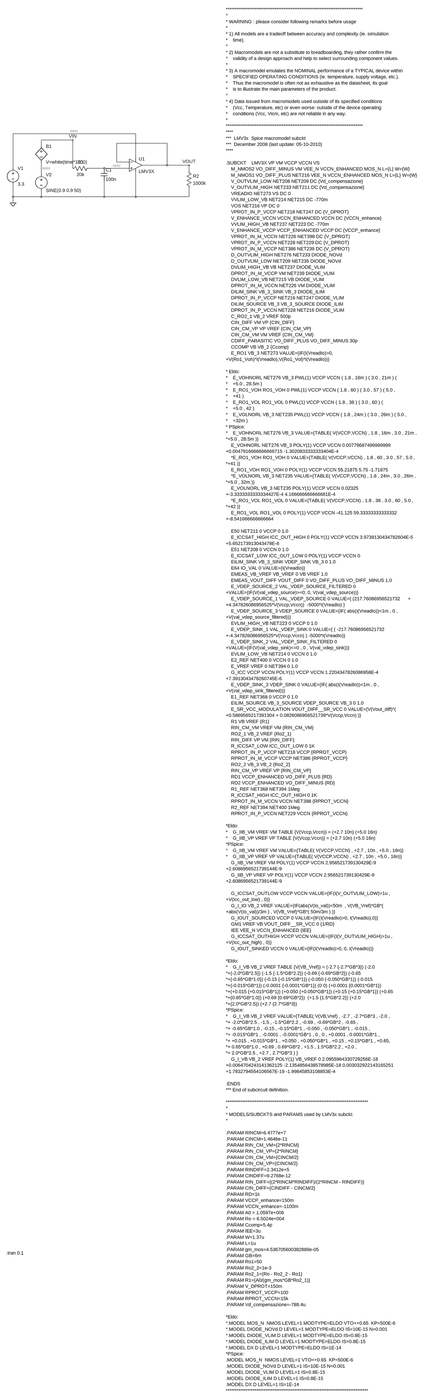
[diagram p0: schematic adc_opamp.asc, whole sheet]
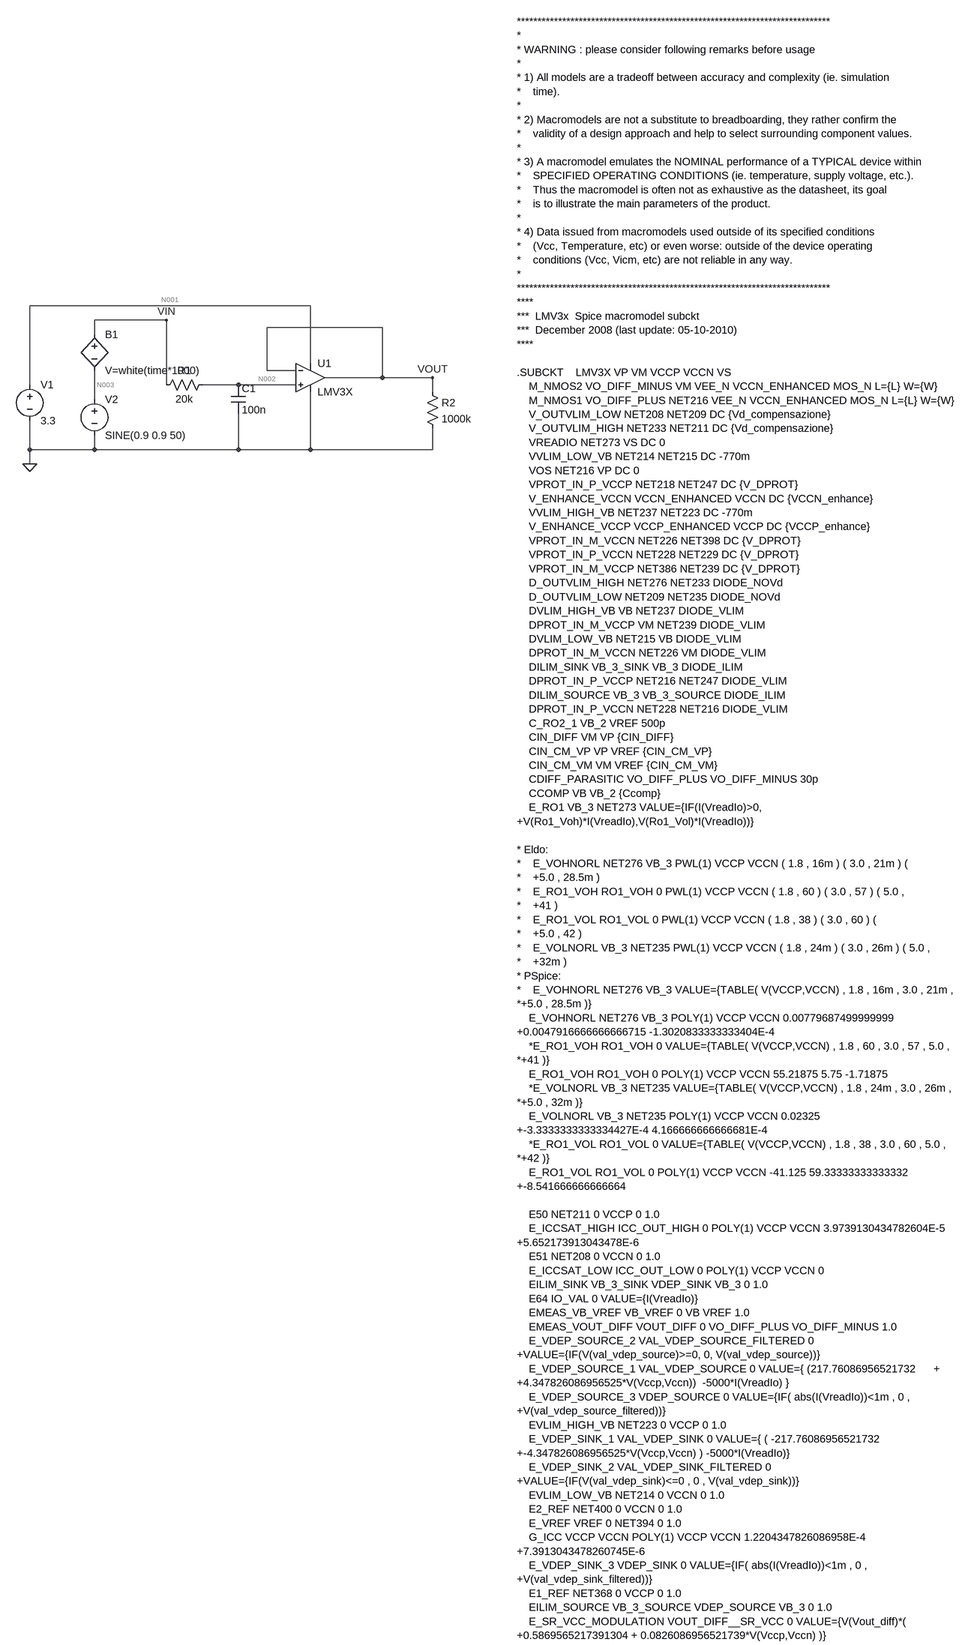
[diagram p1: schematic adc_opamp.asc, part, row 1 of 2, column 1 of 1]
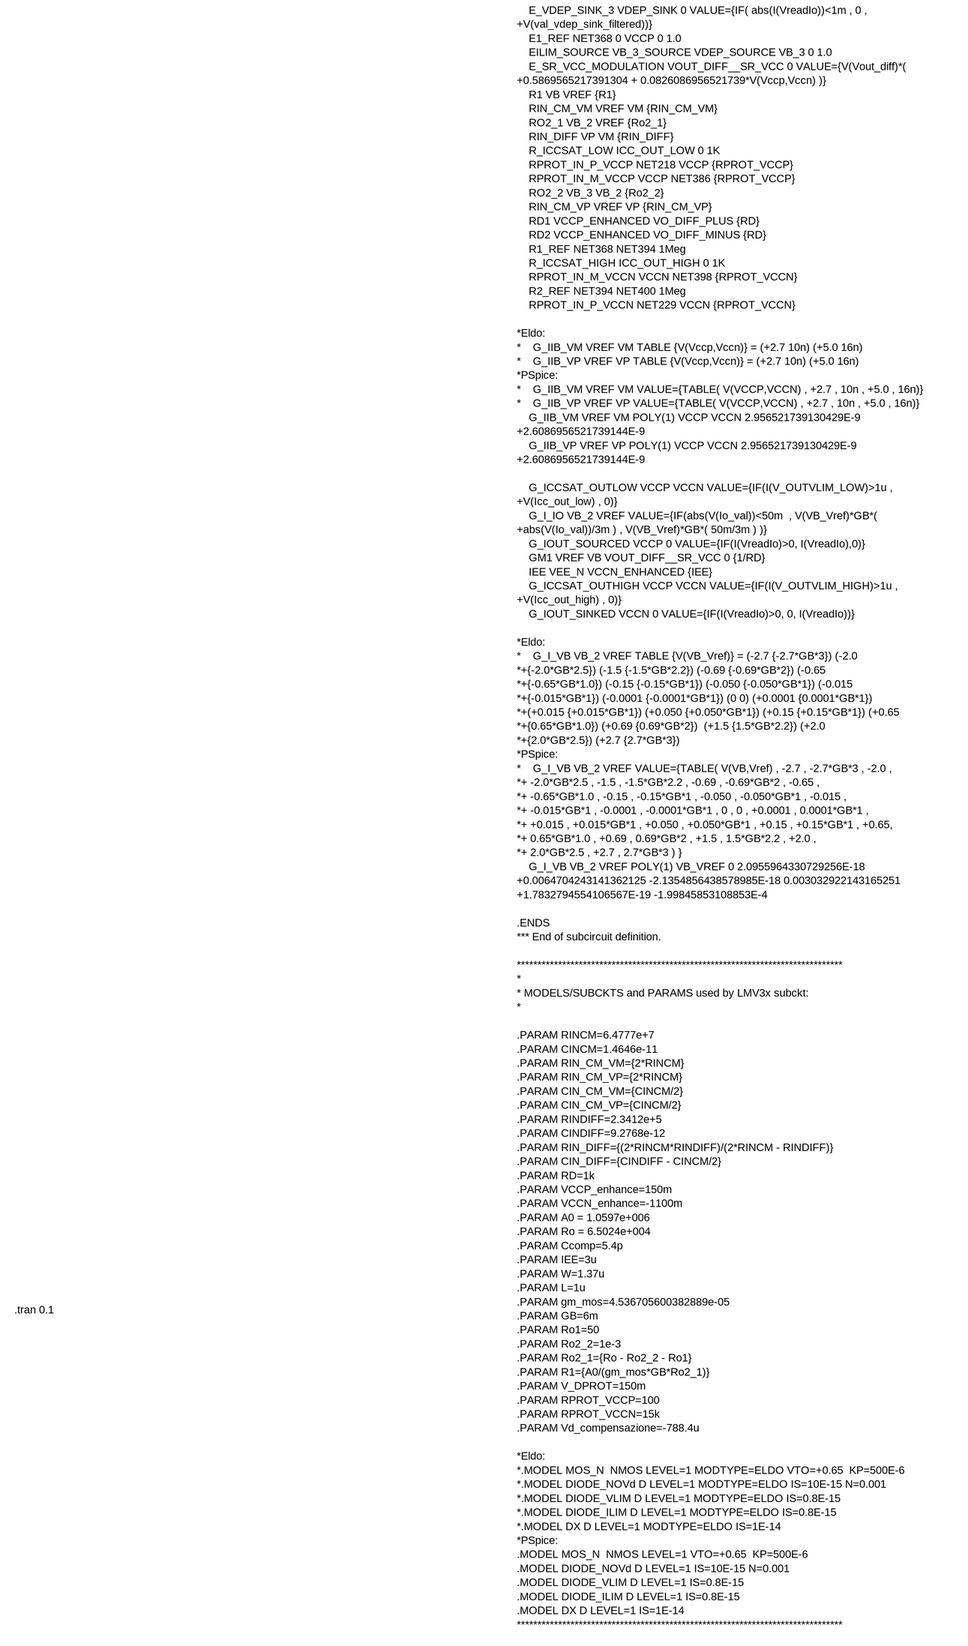
[diagram p2: schematic adc_opamp.asc, part, row 2 of 2, column 1 of 1]
adc_opamp.asc, the LTspice schematic file:
Version 4
SHEET 1 2624 5672
WIRE 656 -32 32 -32
WIRE 336 0 176 0
WIRE 816 16 560 16
WIRE 176 32 176 0
WIRE 656 96 656 -32
WIRE 560 112 560 16
WIRE 624 112 560 112
WIRE 816 128 816 16
WIRE 816 128 688 128
WIRE 928 128 816 128
WIRE 32 144 32 -32
WIRE 336 144 336 0
WIRE 496 144 416 144
WIRE 624 144 496 144
WIRE 928 160 928 128
WIRE 176 176 176 112
WIRE 32 288 32 224
WIRE 176 288 176 256
WIRE 176 288 32 288
WIRE 496 288 496 208
WIRE 496 288 176 288
WIRE 656 288 656 160
WIRE 656 288 496 288
WIRE 928 288 928 240
WIRE 928 288 656 288
WIRE 32 320 32 288
FLAG 32 320 0
FLAG 336 0 VIN
FLAG 928 128 VOUT
SYMBOL voltage 32 128 R0
WINDOW 123 0 0 Left 0
WINDOW 39 0 0 Left 0
SYMATTR InstName V1
SYMATTR Value 3.3
SYMBOL res 432 128 R90
WINDOW 0 0 56 VBottom 2
WINDOW 3 32 56 VTop 2
SYMATTR InstName R1
SYMATTR Value 20k
SYMBOL cap 480 144 R0
SYMATTR InstName C1
SYMATTR Value 100n
SYMBOL OpAmps\\opamp2 656 64 R0
SYMATTR InstName U1
SYMATTR Value LMV3X
SYMBOL res 912 144 R0
SYMATTR InstName R2
SYMATTR Value 1000k
SYMBOL bv 176 16 R0
SYMATTR InstName B1
SYMATTR Value V=white(time*1000)
SYMBOL voltage 176 160 R0
WINDOW 123 0 0 Left 0
WINDOW 39 0 0 Left 0
SYMATTR InstName V2
SYMATTR Value SINE(0.9 0.9 50)
TEXT 1464 -664 Left 2 !****************************************************************************\n*\n* WARNING : please consider following remarks before usage\n*\n* 1) All models are a tradeoff between accuracy and complexity (ie. simulation\n*    time).\n*\n* 2) Macromodels are not a substitute to breadboarding, they rather confirm the\n*    validity of a design approach and help to select surrounding component values.\n*\n* 3) A macromodel emulates the NOMINAL performance of a TYPICAL device within\n*    SPECIFIED OPERATING CONDITIONS (ie. temperature, supply voltage, etc.).\n*    Thus the macromodel is often not as exhaustive as the datasheet, its goal\n*    is to illustrate the main parameters of the product.\n*\n* 4) Data issued from macromodels used outside of its specified conditions\n*    (Vcc, Temperature, etc) or even worse: outside of the device operating\n*    conditions (Vcc, Vicm, etc) are not reliable in any way.\n*\n****************************************************************************\n****\n***  LMV3x  Spice macromodel subckt \n***  December 2008 (last update: 05-10-2010)\n****                      \n  \n.SUBCKT    LMV3X VP VM VCCP VCCN VS\n    M_NMOS2 VO_DIFF_MINUS VM VEE_N VCCN_ENHANCED MOS_N L={L} W={W}\n    M_NMOS1 VO_DIFF_PLUS NET216 VEE_N VCCN_ENHANCED MOS_N L={L} W={W}\n    V_OUTVLIM_LOW NET208 NET209 DC {Vd_compensazione}\n    V_OUTVLIM_HIGH NET233 NET211 DC {Vd_compensazione}\n    VREADIO NET273 VS DC 0\n    VVLIM_LOW_VB NET214 NET215 DC -770m\n    VOS NET216 VP DC 0\n    VPROT_IN_P_VCCP NET218 NET247 DC {V_DPROT}\n    V_ENHANCE_VCCN VCCN_ENHANCED VCCN DC {VCCN_enhance}\n    VVLIM_HIGH_VB NET237 NET223 DC -770m\n    V_ENHANCE_VCCP VCCP_ENHANCED VCCP DC {VCCP_enhance}\n    VPROT_IN_M_VCCN NET226 NET398 DC {V_DPROT}\n    VPROT_IN_P_VCCN NET228 NET229 DC {V_DPROT}\n    VPROT_IN_M_VCCP NET386 NET239 DC {V_DPROT}\n    D_OUTVLIM_HIGH NET276 NET233 DIODE_NOVd\n    D_OUTVLIM_LOW NET209 NET235 DIODE_NOVd\n    DVLIM_HIGH_VB VB NET237 DIODE_VLIM\n    DPROT_IN_M_VCCP VM NET239 DIODE_VLIM\n    DVLIM_LOW_VB NET215 VB DIODE_VLIM\n    DPROT_IN_M_VCCN NET226 VM DIODE_VLIM\n    DILIM_SINK VB_3_SINK VB_3 DIODE_ILIM\n    DPROT_IN_P_VCCP NET216 NET247 DIODE_VLIM\n    DILIM_SOURCE VB_3 VB_3_SOURCE DIODE_ILIM\n    DPROT_IN_P_VCCN NET228 NET216 DIODE_VLIM\n    C_RO2_1 VB_2 VREF 500p\n    CIN_DIFF VM VP {CIN_DIFF}\n    CIN_CM_VP VP VREF {CIN_CM_VP}\n    CIN_CM_VM VM VREF {CIN_CM_VM}\n    CDIFF_PARASITIC VO_DIFF_PLUS VO_DIFF_MINUS 30p\n    CCOMP VB VB_2 {Ccomp}\n    E_RO1 VB_3 NET273 VALUE={IF(I(VreadIo)>0,\n+V(Ro1_Voh)*I(VreadIo),V(Ro1_Vol)*I(VreadIo))}\n \n* Eldo:\n*    E_VOHNORL NET276 VB_3 PWL(1) VCCP VCCN ( 1.8 , 16m ) ( 3.0 , 21m ) (\n*    +5.0 , 28.5m )\n*    E_RO1_VOH RO1_VOH 0 PWL(1) VCCP VCCN ( 1.8 , 60 ) ( 3.0 , 57 ) ( 5.0 ,\n*    +41 )\n*    E_RO1_VOL RO1_VOL 0 PWL(1) VCCP VCCN ( 1.8 , 38 ) ( 3.0 , 60 ) (\n*    +5.0 , 42 )\n*    E_VOLNORL VB_3 NET235 PWL(1) VCCP VCCN ( 1.8 , 24m ) ( 3.0 , 26m ) ( 5.0 ,\n*    +32m )\n* PSpice:\n*    E_VOHNORL NET276 VB_3 VALUE={TABLE( V(VCCP,VCCN) , 1.8 , 16m , 3.0 , 21m ,\n*+5.0 , 28.5m )}\n    E_VOHNORL NET276 VB_3 POLY(1) VCCP VCCN 0.00779687499999999\n+0.0047916666666666715 -1.3020833333333404E-4\n    *E_RO1_VOH RO1_VOH 0 VALUE={TABLE( V(VCCP,VCCN) , 1.8 , 60 , 3.0 , 57 , 5.0 ,\n*+41 )}\n    E_RO1_VOH RO1_VOH 0 POLY(1) VCCP VCCN 55.21875 5.75 -1.71875\n    *E_VOLNORL VB_3 NET235 VALUE={TABLE( V(VCCP,VCCN) , 1.8 , 24m , 3.0 , 26m ,\n*+5.0 , 32m )}\n    E_VOLNORL VB_3 NET235 POLY(1) VCCP VCCN 0.02325\n+-3.3333333333334427E-4 4.166666666666681E-4\n    *E_RO1_VOL RO1_VOL 0 VALUE={TABLE( V(VCCP,VCCN) , 1.8 , 38 , 3.0 , 60 , 5.0 ,\n*+42 )}\n    E_RO1_VOL RO1_VOL 0 POLY(1) VCCP VCCN -41.125 59.33333333333332\n+-8.541666666666664\n \n    E50 NET211 0 VCCP 0 1.0\n    E_ICCSAT_HIGH ICC_OUT_HIGH 0 POLY(1) VCCP VCCN 3.9739130434782604E-5\n+5.652173913043478E-6\n    E51 NET208 0 VCCN 0 1.0\n    E_ICCSAT_LOW ICC_OUT_LOW 0 POLY(1) VCCP VCCN 0    \n    EILIM_SINK VB_3_SINK VDEP_SINK VB_3 0 1.0\n    E64 IO_VAL 0 VALUE={I(VreadIo)}\n    EMEAS_VB_VREF VB_VREF 0 VB VREF 1.0\n    EMEAS_VOUT_DIFF VOUT_DIFF 0 VO_DIFF_PLUS VO_DIFF_MINUS 1.0\n    E_VDEP_SOURCE_2 VAL_VDEP_SOURCE_FILTERED 0\n+VALUE={IF(V(val_vdep_source)>=0, 0, V(val_vdep_source))}\n    E_VDEP_SOURCE_1 VAL_VDEP_SOURCE 0 VALUE={ (217.76086956521732      +\n+4.347826086956525*V(Vccp,Vccn))  -5000*I(VreadIo) }\n    E_VDEP_SOURCE_3 VDEP_SOURCE 0 VALUE={IF( abs(I(VreadIo))<1m , 0 ,\n+V(val_vdep_source_filtered))}\n    EVLIM_HIGH_VB NET223 0 VCCP 0 1.0\n    E_VDEP_SINK_1 VAL_VDEP_SINK 0 VALUE={ ( -217.76086956521732\n+-4.347826086956525*V(Vccp,Vccn) ) -5000*I(VreadIo)}\n    E_VDEP_SINK_2 VAL_VDEP_SINK_FILTERED 0\n+VALUE={IF(V(val_vdep_sink)<=0 , 0 , V(val_vdep_sink))}\n    EVLIM_LOW_VB NET214 0 VCCN 0 1.0\n    E2_REF NET400 0 VCCN 0 1.0\n    E_VREF VREF 0 NET394 0 1.0\n    G_ICC VCCP VCCN POLY(1) VCCP VCCN 1.2204347826086958E-4\n+7.3913043478260745E-6\n    E_VDEP_SINK_3 VDEP_SINK 0 VALUE={IF( abs(I(VreadIo))<1m , 0 ,\n+V(val_vdep_sink_filtered))}\n    E1_REF NET368 0 VCCP 0 1.0\n    EILIM_SOURCE VB_3_SOURCE VDEP_SOURCE VB_3 0 1.0\n    E_SR_VCC_MODULATION VOUT_DIFF__SR_VCC 0 VALUE={V(Vout_diff)*(\n+0.5869565217391304 + 0.0826086956521739*V(Vccp,Vccn) )}\n    R1 VB VREF {R1}\n    RIN_CM_VM VREF VM {RIN_CM_VM}\n    RO2_1 VB_2 VREF {Ro2_1}\n    RIN_DIFF VP VM {RIN_DIFF}\n    R_ICCSAT_LOW ICC_OUT_LOW 0 1K\n    RPROT_IN_P_VCCP NET218 VCCP {RPROT_VCCP}\n    RPROT_IN_M_VCCP VCCP NET386 {RPROT_VCCP}\n    RO2_2 VB_3 VB_2 {Ro2_2}\n    RIN_CM_VP VREF VP {RIN_CM_VP}\n    RD1 VCCP_ENHANCED VO_DIFF_PLUS {RD}\n    RD2 VCCP_ENHANCED VO_DIFF_MINUS {RD}\n    R1_REF NET368 NET394 1Meg\n    R_ICCSAT_HIGH ICC_OUT_HIGH 0 1K\n    RPROT_IN_M_VCCN VCCN NET398 {RPROT_VCCN}\n    R2_REF NET394 NET400 1Meg\n    RPROT_IN_P_VCCN NET229 VCCN {RPROT_VCCN}\n \n*Eldo:\n*    G_IIB_VM VREF VM TABLE {V(Vccp,Vccn)} = (+2.7 10n) (+5.0 16n)\n*    G_IIB_VP VREF VP TABLE {V(Vccp,Vccn)} = (+2.7 10n) (+5.0 16n)\n*PSpice:\n*    G_IIB_VM VREF VM VALUE={TABLE( V(VCCP,VCCN) , +2.7 , 10n , +5.0 , 16n)}\n*    G_IIB_VP VREF VP VALUE={TABLE( V(VCCP,VCCN) , +2.7 , 10n , +5.0 , 16n)}\n    G_IIB_VM VREF VM POLY(1) VCCP VCCN 2.956521739130429E-9\n+2.6086956521739144E-9\n    G_IIB_VP VREF VP POLY(1) VCCP VCCN 2.956521739130429E-9\n+2.6086956521739144E-9\n \n    G_ICCSAT_OUTLOW VCCP VCCN VALUE={IF(I(V_OUTVLIM_LOW)>1u ,\n+V(Icc_out_low) , 0)}\n    G_I_IO VB_2 VREF VALUE={IF(abs(V(Io_val))<50m  , V(VB_Vref)*GB*(\n+abs(V(Io_val))/3m ) , V(VB_Vref)*GB*( 50m/3m ) )}\n    G_IOUT_SOURCED VCCP 0 VALUE={IF(I(VreadIo)>0, I(VreadIo),0)}\n    GM1 VREF VB VOUT_DIFF__SR_VCC 0 {1/RD}    \n    IEE VEE_N VCCN_ENHANCED {IEE}\n    G_ICCSAT_OUTHIGH VCCP VCCN VALUE={IF(I(V_OUTVLIM_HIGH)>1u ,\n+V(Icc_out_high) , 0)}\n    G_IOUT_SINKED VCCN 0 VALUE={IF(I(VreadIo)>0, 0, I(VreadIo))}\n    \n*Eldo:    \n*    G_I_VB VB_2 VREF TABLE {V(VB_Vref)} = (-2.7 {-2.7*GB*3}) (-2.0\n*+{-2.0*GB*2.5}) (-1.5 {-1.5*GB*2.2}) (-0.69 {-0.69*GB*2}) (-0.65\n*+{-0.65*GB*1.0}) (-0.15 {-0.15*GB*1}) (-0.050 {-0.050*GB*1}) (-0.015\n*+{-0.015*GB*1}) (-0.0001 {-0.0001*GB*1}) (0 0) (+0.0001 {0.0001*GB*1})\n*+(+0.015 {+0.015*GB*1}) (+0.050 {+0.050*GB*1}) (+0.15 {+0.15*GB*1}) (+0.65\n*+{0.65*GB*1.0}) (+0.69 {0.69*GB*2})  (+1.5 {1.5*GB*2.2}) (+2.0\n*+{2.0*GB*2.5}) (+2.7 {2.7*GB*3})  \n*PSpice:\n*    G_I_VB VB_2 VREF VALUE={TABLE( V(VB,Vref) , -2.7 , -2.7*GB*3 , -2.0 ,\n*+ -2.0*GB*2.5 , -1.5 , -1.5*GB*2.2 , -0.69 , -0.69*GB*2 , -0.65 ,\n*+ -0.65*GB*1.0 , -0.15 , -0.15*GB*1 , -0.050 , -0.050*GB*1 , -0.015 ,\n*+ -0.015*GB*1 , -0.0001 , -0.0001*GB*1 , 0 , 0 , +0.0001 , 0.0001*GB*1 ,\n*+ +0.015 , +0.015*GB*1 , +0.050 , +0.050*GB*1 , +0.15 , +0.15*GB*1 , +0.65,\n*+ 0.65*GB*1.0 , +0.69 , 0.69*GB*2 , +1.5 , 1.5*GB*2.2 , +2.0 ,\n*+ 2.0*GB*2.5 , +2.7 , 2.7*GB*3 ) }\n    G_I_VB VB_2 VREF POLY(1) VB_VREF 0 2.0955964330729256E-18\n+0.0064704243141362125 -2.1354856438578985E-18 0.003032922143165251\n+1.7832794554106567E-19 -1.99845853108853E-4\n \n.ENDS\n*** End of subcircuit definition.\n \n*******************************************************************************\n*\n* MODELS/SUBCKTS and PARAMS used by LMV3x subckt:\n*\n \n.PARAM RINCM=6.4777e+7\n.PARAM CINCM=1.4646e-11\n.PARAM RIN_CM_VM={2*RINCM}\n.PARAM RIN_CM_VP={2*RINCM}\n.PARAM CIN_CM_VM={CINCM/2}\n.PARAM CIN_CM_VP={CINCM/2}\n.PARAM RINDIFF=2.3412e+5\n.PARAM CINDIFF=9.2768e-12\n.PARAM RIN_DIFF={(2*RINCM*RINDIFF)/(2*RINCM - RINDIFF)}\n.PARAM CIN_DIFF={CINDIFF - CINCM/2}\n.PARAM RD=1k\n.PARAM VCCP_enhance=150m\n.PARAM VCCN_enhance=-1100m \n.PARAM A0 = 1.0597e+006\n.PARAM Ro = 6.5024e+004\n.PARAM Ccomp=5.4p \n.PARAM IEE=3u\n.PARAM W=1.37u\n.PARAM L=1u\n.PARAM gm_mos=4.536705600382889e-05\n.PARAM GB=6m \n.PARAM Ro1=50\n.PARAM Ro2_2=1e-3 \n.PARAM Ro2_1={Ro - Ro2_2 - Ro1} \n.PARAM R1={A0/(gm_mos*GB*Ro2_1)}\n.PARAM V_DPROT=150m\n.PARAM RPROT_VCCP=100\n.PARAM RPROT_VCCN=15k\n.PARAM Vd_compensazione=-788.4u\n \n*Eldo:\n*.MODEL MOS_N  NMOS LEVEL=1 MODTYPE=ELDO VTO=+0.65  KP=500E-6 \n*.MODEL DIODE_NOVd D LEVEL=1 MODTYPE=ELDO IS=10E-15 N=0.001\n*.MODEL DIODE_VLIM D LEVEL=1 MODTYPE=ELDO IS=0.8E-15   \n*.MODEL DIODE_ILIM D LEVEL=1 MODTYPE=ELDO IS=0.8E-15  \n*.MODEL DX D LEVEL=1 MODTYPE=ELDO IS=1E-14 \n*PSpice:\n.MODEL MOS_N  NMOS LEVEL=1 VTO=+0.65  KP=500E-6 \n.MODEL DIODE_NOVd D LEVEL=1 IS=10E-15 N=0.001\n.MODEL DIODE_VLIM D LEVEL=1 IS=0.8E-15   \n.MODEL DIODE_ILIM D LEVEL=1 IS=0.8E-15  \n.MODEL DX D LEVEL=1 IS=1E-14 \n*******************************************************************************
TEXT -2 5656 Left 2 !.tran 0.1

The netlist it stands for:
* adc_opamp.asc
V1 N001 0 3.3
R1 N002 VIN 20k
C1 N002 0 100n
XU1 N002 VOUT N001 0 VOUT LMV3X  ; pins In+ In- V+ V- OUT
R2 VOUT 0 1000k
B1 VIN N003 V=white(time*1000)
V2 N003 0 SINE(0.9 0.9 50)
****************************************************************************
*
* WARNING : please consider following remarks before usage
*
* 1) All models are a tradeoff between accuracy and complexity (ie. simulation
*    time).
*
* 2) Macromodels are not a substitute to breadboarding, they rather confirm the
*    validity of a design approach and help to select surrounding component values.
*
* 3) A macromodel emulates the NOMINAL performance of a TYPICAL device within
*    SPECIFIED OPERATING CONDITIONS (ie. temperature, supply voltage, etc.).
*    Thus the macromodel is often not as exhaustive as the datasheet, its goal
*    is to illustrate the main parameters of the product.
*
* 4) Data issued from macromodels used outside of its specified conditions
*    (Vcc, Temperature, etc) or even worse: outside of the device operating
*    conditions (Vcc, Vicm, etc) are not reliable in any way.
*
****************************************************************************
****
***  LMV3x  Spice macromodel subckt
***  December 2008 (last update: 05-10-2010)
****
.SUBCKT    LMV3X VP VM VCCP VCCN VS
    M_NMOS2 VO_DIFF_MINUS VM VEE_N VCCN_ENHANCED MOS_N L={L} W={W}
    M_NMOS1 VO_DIFF_PLUS NET216 VEE_N VCCN_ENHANCED MOS_N L={L} W={W}
    V_OUTVLIM_LOW NET208 NET209 DC {Vd_compensazione}
    V_OUTVLIM_HIGH NET233 NET211 DC {Vd_compensazione}
    VREADIO NET273 VS DC 0
    VVLIM_LOW_VB NET214 NET215 DC -770m
    VOS NET216 VP DC 0
    VPROT_IN_P_VCCP NET218 NET247 DC {V_DPROT}
    V_ENHANCE_VCCN VCCN_ENHANCED VCCN DC {VCCN_enhance}
    VVLIM_HIGH_VB NET237 NET223 DC -770m
    V_ENHANCE_VCCP VCCP_ENHANCED VCCP DC {VCCP_enhance}
    VPROT_IN_M_VCCN NET226 NET398 DC {V_DPROT}
    VPROT_IN_P_VCCN NET228 NET229 DC {V_DPROT}
    VPROT_IN_M_VCCP NET386 NET239 DC {V_DPROT}
    D_OUTVLIM_HIGH NET276 NET233 DIODE_NOVd
    D_OUTVLIM_LOW NET209 NET235 DIODE_NOVd
    DVLIM_HIGH_VB VB NET237 DIODE_VLIM
    DPROT_IN_M_VCCP VM NET239 DIODE_VLIM
    DVLIM_LOW_VB NET215 VB DIODE_VLIM
    DPROT_IN_M_VCCN NET226 VM DIODE_VLIM
    DILIM_SINK VB_3_SINK VB_3 DIODE_ILIM
    DPROT_IN_P_VCCP NET216 NET247 DIODE_VLIM
    DILIM_SOURCE VB_3 VB_3_SOURCE DIODE_ILIM
    DPROT_IN_P_VCCN NET228 NET216 DIODE_VLIM
    C_RO2_1 VB_2 VREF 500p
    CIN_DIFF VM VP {CIN_DIFF}
    CIN_CM_VP VP VREF {CIN_CM_VP}
    CIN_CM_VM VM VREF {CIN_CM_VM}
    CDIFF_PARASITIC VO_DIFF_PLUS VO_DIFF_MINUS 30p
    CCOMP VB VB_2 {Ccomp}
    E_RO1 VB_3 NET273 VALUE={IF(I(VreadIo)>0,
+V(Ro1_Voh)*I(VreadIo),V(Ro1_Vol)*I(VreadIo))}
* Eldo:
*    E_VOHNORL NET276 VB_3 PWL(1) VCCP VCCN ( 1.8 , 16m ) ( 3.0 , 21m ) (
*    +5.0 , 28.5m )
*    E_RO1_VOH RO1_VOH 0 PWL(1) VCCP VCCN ( 1.8 , 60 ) ( 3.0 , 57 ) ( 5.0 ,
*    +41 )
*    E_RO1_VOL RO1_VOL 0 PWL(1) VCCP VCCN ( 1.8 , 38 ) ( 3.0 , 60 ) (
*    +5.0 , 42 )
*    E_VOLNORL VB_3 NET235 PWL(1) VCCP VCCN ( 1.8 , 24m ) ( 3.0 , 26m ) ( 5.0 ,
*    +32m )
* PSpice:
*    E_VOHNORL NET276 VB_3 VALUE={TABLE( V(VCCP,VCCN) , 1.8 , 16m , 3.0 , 21m ,
*+5.0 , 28.5m )}
    E_VOHNORL NET276 VB_3 POLY(1) VCCP VCCN 0.00779687499999999
+0.0047916666666666715 -1.3020833333333404E-4
    *E_RO1_VOH RO1_VOH 0 VALUE={TABLE( V(VCCP,VCCN) , 1.8 , 60 , 3.0 , 57 , 5.0 ,
*+41 )}
    E_RO1_VOH RO1_VOH 0 POLY(1) VCCP VCCN 55.21875 5.75 -1.71875
    *E_VOLNORL VB_3 NET235 VALUE={TABLE( V(VCCP,VCCN) , 1.8 , 24m , 3.0 , 26m ,
*+5.0 , 32m )}
    E_VOLNORL VB_3 NET235 POLY(1) VCCP VCCN 0.02325
+-3.3333333333334427E-4 4.166666666666681E-4
    *E_RO1_VOL RO1_VOL 0 VALUE={TABLE( V(VCCP,VCCN) , 1.8 , 38 , 3.0 , 60 , 5.0 ,
*+42 )}
    E_RO1_VOL RO1_VOL 0 POLY(1) VCCP VCCN -41.125 59.33333333333332
+-8.541666666666664
    E50 NET211 0 VCCP 0 1.0
    E_ICCSAT_HIGH ICC_OUT_HIGH 0 POLY(1) VCCP VCCN 3.9739130434782604E-5
+5.652173913043478E-6
    E51 NET208 0 VCCN 0 1.0
    E_ICCSAT_LOW ICC_OUT_LOW 0 POLY(1) VCCP VCCN 0
    EILIM_SINK VB_3_SINK VDEP_SINK VB_3 0 1.0
    E64 IO_VAL 0 VALUE={I(VreadIo)}
    EMEAS_VB_VREF VB_VREF 0 VB VREF 1.0
    EMEAS_VOUT_DIFF VOUT_DIFF 0 VO_DIFF_PLUS VO_DIFF_MINUS 1.0
    E_VDEP_SOURCE_2 VAL_VDEP_SOURCE_FILTERED 0
+VALUE={IF(V(val_vdep_source)>=0, 0, V(val_vdep_source))}
    E_VDEP_SOURCE_1 VAL_VDEP_SOURCE 0 VALUE={ (217.76086956521732      +
+4.347826086956525*V(Vccp,Vccn))  -5000*I(VreadIo) }
    E_VDEP_SOURCE_3 VDEP_SOURCE 0 VALUE={IF( abs(I(VreadIo))<1m , 0 ,
+V(val_vdep_source_filtered))}
    EVLIM_HIGH_VB NET223 0 VCCP 0 1.0
    E_VDEP_SINK_1 VAL_VDEP_SINK 0 VALUE={ ( -217.76086956521732
+-4.347826086956525*V(Vccp,Vccn) ) -5000*I(VreadIo)}
    E_VDEP_SINK_2 VAL_VDEP_SINK_FILTERED 0
+VALUE={IF(V(val_vdep_sink)<=0 , 0 , V(val_vdep_sink))}
    EVLIM_LOW_VB NET214 0 VCCN 0 1.0
    E2_REF NET400 0 VCCN 0 1.0
    E_VREF VREF 0 NET394 0 1.0
    G_ICC VCCP VCCN POLY(1) VCCP VCCN 1.2204347826086958E-4
+7.3913043478260745E-6
    E_VDEP_SINK_3 VDEP_SINK 0 VALUE={IF( abs(I(VreadIo))<1m , 0 ,
+V(val_vdep_sink_filtered))}
    E1_REF NET368 0 VCCP 0 1.0
    EILIM_SOURCE VB_3_SOURCE VDEP_SOURCE VB_3 0 1.0
    E_SR_VCC_MODULATION VOUT_DIFF__SR_VCC 0 VALUE={V(Vout_diff)*(
+0.5869565217391304 + 0.0826086956521739*V(Vccp,Vccn) )}
    R1 VB VREF {R1}
    RIN_CM_VM VREF VM {RIN_CM_VM}
    RO2_1 VB_2 VREF {Ro2_1}
    RIN_DIFF VP VM {RIN_DIFF}
    R_ICCSAT_LOW ICC_OUT_LOW 0 1K
    RPROT_IN_P_VCCP NET218 VCCP {RPROT_VCCP}
    RPROT_IN_M_VCCP VCCP NET386 {RPROT_VCCP}
    RO2_2 VB_3 VB_2 {Ro2_2}
    RIN_CM_VP VREF VP {RIN_CM_VP}
    RD1 VCCP_ENHANCED VO_DIFF_PLUS {RD}
    RD2 VCCP_ENHANCED VO_DIFF_MINUS {RD}
    R1_REF NET368 NET394 1Meg
    R_ICCSAT_HIGH ICC_OUT_HIGH 0 1K
    RPROT_IN_M_VCCN VCCN NET398 {RPROT_VCCN}
    R2_REF NET394 NET400 1Meg
    RPROT_IN_P_VCCN NET229 VCCN {RPROT_VCCN}
*Eldo:
*    G_IIB_VM VREF VM TABLE {V(Vccp,Vccn)} = (+2.7 10n) (+5.0 16n)
*    G_IIB_VP VREF VP TABLE {V(Vccp,Vccn)} = (+2.7 10n) (+5.0 16n)
*PSpice:
*    G_IIB_VM VREF VM VALUE={TABLE( V(VCCP,VCCN) , +2.7 , 10n , +5.0 , 16n)}
*    G_IIB_VP VREF VP VALUE={TABLE( V(VCCP,VCCN) , +2.7 , 10n , +5.0 , 16n)}
    G_IIB_VM VREF VM POLY(1) VCCP VCCN 2.956521739130429E-9
+2.6086956521739144E-9
    G_IIB_VP VREF VP POLY(1) VCCP VCCN 2.956521739130429E-9
+2.6086956521739144E-9
    G_ICCSAT_OUTLOW VCCP VCCN VALUE={IF(I(V_OUTVLIM_LOW)>1u ,
+V(Icc_out_low) , 0)}
    G_I_IO VB_2 VREF VALUE={IF(abs(V(Io_val))<50m  , V(VB_Vref)*GB*(
+abs(V(Io_val))/3m ) , V(VB_Vref)*GB*( 50m/3m ) )}
    G_IOUT_SOURCED VCCP 0 VALUE={IF(I(VreadIo)>0, I(VreadIo),0)}
    GM1 VREF VB VOUT_DIFF__SR_VCC 0 {1/RD}
    IEE VEE_N VCCN_ENHANCED {IEE}
    G_ICCSAT_OUTHIGH VCCP VCCN VALUE={IF(I(V_OUTVLIM_HIGH)>1u ,
+V(Icc_out_high) , 0)}
    G_IOUT_SINKED VCCN 0 VALUE={IF(I(VreadIo)>0, 0, I(VreadIo))}
*Eldo:
*    G_I_VB VB_2 VREF TABLE {V(VB_Vref)} = (-2.7 {-2.7*GB*3}) (-2.0
*+{-2.0*GB*2.5}) (-1.5 {-1.5*GB*2.2}) (-0.69 {-0.69*GB*2}) (-0.65
*+{-0.65*GB*1.0}) (-0.15 {-0.15*GB*1}) (-0.050 {-0.050*GB*1}) (-0.015
*+{-0.015*GB*1}) (-0.0001 {-0.0001*GB*1}) (0 0) (+0.0001 {0.0001*GB*1})
*+(+0.015 {+0.015*GB*1}) (+0.050 {+0.050*GB*1}) (+0.15 {+0.15*GB*1}) (+0.65
*+{0.65*GB*1.0}) (+0.69 {0.69*GB*2})  (+1.5 {1.5*GB*2.2}) (+2.0
*+{2.0*GB*2.5}) (+2.7 {2.7*GB*3})
*PSpice:
*    G_I_VB VB_2 VREF VALUE={TABLE( V(VB,Vref) , -2.7 , -2.7*GB*3 , -2.0 ,
*+ -2.0*GB*2.5 , -1.5 , -1.5*GB*2.2 , -0.69 , -0.69*GB*2 , -0.65 ,
*+ -0.65*GB*1.0 , -0.15 , -0.15*GB*1 , -0.050 , -0.050*GB*1 , -0.015 ,
*+ -0.015*GB*1 , -0.0001 , -0.0001*GB*1 , 0 , 0 , +0.0001 , 0.0001*GB*1 ,
*+ +0.015 , +0.015*GB*1 , +0.050 , +0.050*GB*1 , +0.15 , +0.15*GB*1 , +0.65,
*+ 0.65*GB*1.0 , +0.69 , 0.69*GB*2 , +1.5 , 1.5*GB*2.2 , +2.0 ,
*+ 2.0*GB*2.5 , +2.7 , 2.7*GB*3 ) }
    G_I_VB VB_2 VREF POLY(1) VB_VREF 0 2.0955964330729256E-18
+0.0064704243141362125 -2.1354856438578985E-18 0.003032922143165251
+1.7832794554106567E-19 -1.99845853108853E-4
.ENDS
*** End of subcircuit definition.
*******************************************************************************
*
* MODELS/SUBCKTS and PARAMS used by LMV3x subckt:
*
.PARAM RINCM=6.4777e+7
.PARAM CINCM=1.4646e-11
.PARAM RIN_CM_VM={2*RINCM}
.PARAM RIN_CM_VP={2*RINCM}
.PARAM CIN_CM_VM={CINCM/2}
.PARAM CIN_CM_VP={CINCM/2}
.PARAM RINDIFF=2.3412e+5
.PARAM CINDIFF=9.2768e-12
.PARAM RIN_DIFF={(2*RINCM*RINDIFF)/(2*RINCM - RINDIFF)}
.PARAM CIN_DIFF={CINDIFF - CINCM/2}
.PARAM RD=1k
.PARAM VCCP_enhance=150m
.PARAM VCCN_enhance=-1100m
.PARAM A0 = 1.0597e+006
.PARAM Ro = 6.5024e+004
.PARAM Ccomp=5.4p
.PARAM IEE=3u
.PARAM W=1.37u
.PARAM L=1u
.PARAM gm_mos=4.536705600382889e-05
.PARAM GB=6m
.PARAM Ro1=50
.PARAM Ro2_2=1e-3
.PARAM Ro2_1={Ro - Ro2_2 - Ro1}
.PARAM R1={A0/(gm_mos*GB*Ro2_1)}
.PARAM V_DPROT=150m
.PARAM RPROT_VCCP=100
.PARAM RPROT_VCCN=15k
.PARAM Vd_compensazione=-788.4u
*Eldo:
*.MODEL MOS_N  NMOS LEVEL=1 MODTYPE=ELDO VTO=+0.65  KP=500E-6
*.MODEL DIODE_NOVd D LEVEL=1 MODTYPE=ELDO IS=10E-15 N=0.001
*.MODEL DIODE_VLIM D LEVEL=1 MODTYPE=ELDO IS=0.8E-15
*.MODEL DIODE_ILIM D LEVEL=1 MODTYPE=ELDO IS=0.8E-15
*.MODEL DX D LEVEL=1 MODTYPE=ELDO IS=1E-14
*PSpice:
.MODEL MOS_N  NMOS LEVEL=1 VTO=+0.65  KP=500E-6
.MODEL DIODE_NOVd D LEVEL=1 IS=10E-15 N=0.001
.MODEL DIODE_VLIM D LEVEL=1 IS=0.8E-15
.MODEL DIODE_ILIM D LEVEL=1 IS=0.8E-15
.MODEL DX D LEVEL=1 IS=1E-14
*******************************************************************************
.tran 0.1
.backanno
.end

* Results of the author's LTspice run, read from the files saved beside the schematic
* Operating Point, zero values left out:
*   V(n001) = 3.3 V
*   V(n002) = 900.3 mV
*   V(vin) = 900 mV
*   V(vout) = 900.3 mV
*   V(n003) = 900 mV
*   I(B1) = 17.36 nA
*   I(R1) = 17.36 nA
*   I(R2) = 900.3 nA
*   I(V1) = -150.3 µA
*   I(V2) = 17.36 nA
*   Ix(u1:VP) = -17.36 nA
*   Ix(u1:VM) = -17.35 nA
*   Ix(u1:VCCP) = 150.3 µA
*   Ix(u1:VCCN) = -149.4 µA
*   Ix(u1:VS) = -883 nA
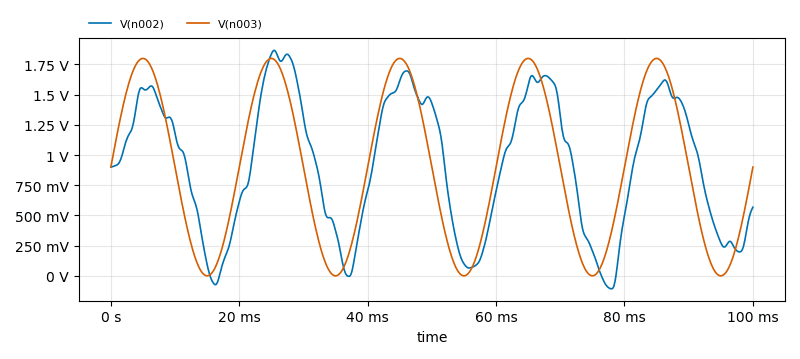
[diagram p3: Transient Analysis of adc_opamp.asc, plotted from the saved traces]
* Transient Analysis, 1 run:
*   V(n002): min -107.3 mV, max 1.867 V, average 923.5 mV, rms 1.086 V, last 568 mV
*   V(n003): min 8.252 µV, max 1.8 V, average 900 mV, rms 1.102 V, last 900 mV